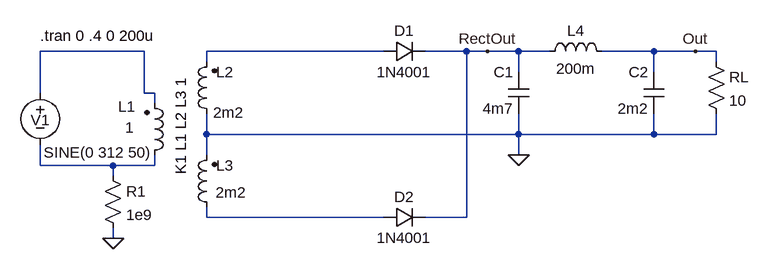
[diagram p0: schematic DiametrafoRect&FiltPi.asc]
DiametrafoRect&FiltPi.asc, the LTspice schematic file:
Version 4
SHEET 1 880 680
WIRE -144 112 -304 112
WIRE 224 112 -48 112
WIRE 352 112 288 112
WIRE 384 112 352 112
WIRE 432 112 384 112
WIRE 480 112 432 112
WIRE 640 112 560 112
WIRE 704 112 640 112
WIRE 736 112 704 112
WIRE -48 128 -48 112
WIRE 736 128 736 112
WIRE 432 144 432 112
WIRE 640 144 640 112
WIRE -304 176 -304 112
WIRE -144 176 -144 112
WIRE -128 176 -144 176
WIRE -128 192 -128 176
WIRE -48 240 -48 208
WIRE 432 240 432 208
WIRE 432 240 -48 240
WIRE 640 240 640 208
WIRE 640 240 432 240
WIRE 736 240 736 208
WIRE 736 240 640 240
WIRE -48 272 -48 240
WIRE 432 272 432 240
WIRE -304 288 -304 256
WIRE -192 288 -304 288
WIRE -128 288 -128 272
WIRE -128 288 -192 288
WIRE -192 304 -192 288
WIRE -48 368 -48 352
WIRE 224 368 -48 368
WIRE 352 368 352 112
WIRE 352 368 288 368
WIRE -192 400 -192 384
FLAG 432 272 0
FLAG -192 400 0
FLAG 704 112 Out
FLAG 384 112 RectOut
SYMBOL ind2 -32 224 R180
WINDOW 0 -26 80 Left 0
WINDOW 3 -41 18 Left 0
SYMATTR InstName L2
SYMATTR Value 2m2
SYMBOL ind2 -32 368 R180
WINDOW 0 -26 80 Left 0
WINDOW 3 -45 39 Left 0
SYMATTR InstName L3
SYMATTR Value 2m2
SYMBOL ind2 -144 288 M180
WINDOW 0 -40 91 Left 0
WINDOW 3 -29 59 Left 0
SYMATTR InstName L1
SYMATTR Value 1
SYMATTR SpiceLine Rser=1
SYMBOL voltage -304 160 R0
WINDOW 0 -15 58 Left 0
WINDOW 3 5 108 Left 0
WINDOW 123 0 0 Left 0
WINDOW 39 0 0 Left 0
SYMATTR InstName V1
SYMATTR Value SINE(0 312 50)
SYMBOL res -208 288 R0
SYMATTR InstName R1
SYMATTR Value 1e9
SYMBOL diode 224 128 R270
WINDOW 0 32 32 VTop 0
WINDOW 3 0 32 VBottom 0
SYMATTR InstName D1
SYMATTR Value 1N4001
SYMBOL diode 224 384 R270
WINDOW 0 32 32 VTop 0
WINDOW 3 0 32 VBottom 0
SYMATTR InstName D2
SYMATTR Value 1N4001
SYMBOL cap 448 208 R180
WINDOW 0 24 64 Left 0
WINDOW 3 24 8 Left 0
SYMATTR InstName C1
SYMATTR Value 4m7
SYMBOL res 720 112 R0
SYMATTR InstName RL
SYMATTR Value 10
SYMBOL ind 464 128 R270
WINDOW 0 32 56 VTop 0
WINDOW 3 5 56 VBottom 0
SYMATTR InstName L4
SYMATTR Value 200m
SYMBOL cap 656 208 R180
WINDOW 0 24 64 Left 0
WINDOW 3 24 8 Left 0
SYMATTR InstName C2
SYMATTR Value 2m2
TEXT -88 152 VRight 0 !K1 L1 L2 L3 1
TEXT -304 88 Left 0 !.tran 0 .4 0 200u

The netlist it stands for:
* DiametrafoRect&FiltPi.asc
L2 0 N002 2m2
L3 N004 0 2m2
L1 N003 N001 1 Rser=1
V1 N001 N003 SINE(0 312 50)
R1 N003 0 1e9
D1 N002 RectOut 1N4001
D2 N004 RectOut 1N4001
C1 0 RectOut 4m7
RL Out 0 10
L4 RectOut Out 200m
C2 0 Out 2m2
.model D D
.lib standard.dio
K1 L1 L2 L3 1
.tran 0 .4 0 200u
.backanno
.end